# EasyEDA Pro project ax08_doc.eprj, board io
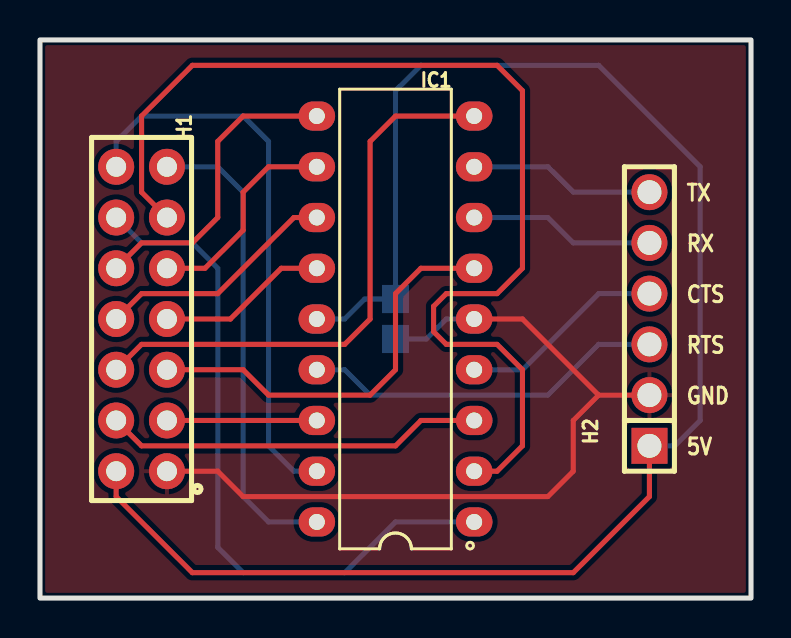
[diagram p28: board, top side]
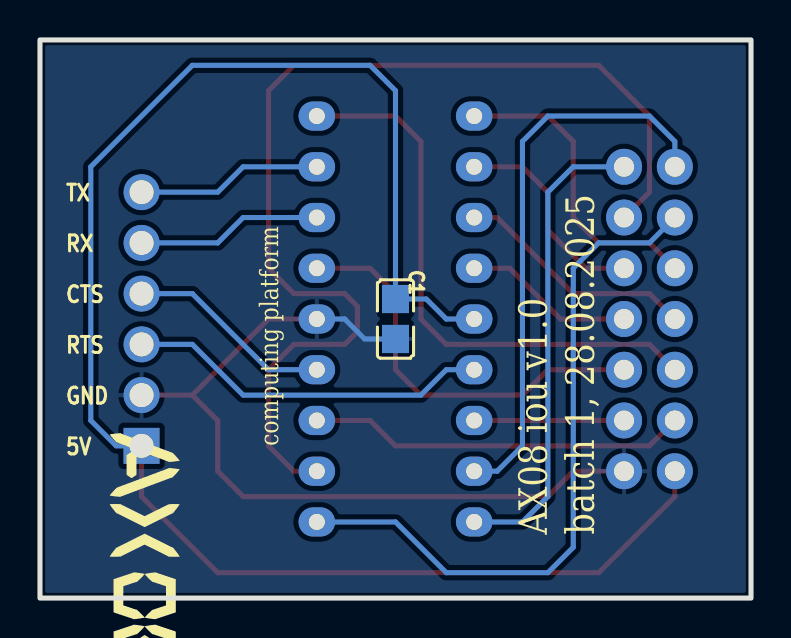
[diagram p29: board, bottom side, seen from below]

Outline 35.56 x 27.94 mm; copper layers: Top Layer, Bottom Layer. Coordinates in mm from the lower left corner of the outline.
Outline path: rectangle 0,27.94 35.56,0
Stack: Top Layer 0.035mm / Dielectric1 1.51mm FR4 er 4.5 / Bottom Layer 0.035mm

## Design rules (mm)
template: JLCPCB Capability(Two Layers Board)
spacing copperThickness1oz (default): track to track 0.102, other pairs 0.152 to 0.3
spacing copperThickness2oz: track to track 0.203, other pairs 0.152 to 0.3
track width copperThickness1oz (default): min 0.127, default 0.254, max 2.54
track width copperThickness2oz: min 0.203, default 0.254, max 2.54
differential pair differentialPair (default): width min 0.127, default 0.254, max 2.54; gap min 0.152, default 0.152
via viaSize (default): diameter min 0.5, default 0.61, max 10; hole min 0.3, default 0.305, max 6.3

## Placement (name value [footprint] x y rotation side)
C1  100nF  [C0805]  17.78 13.97 90 bottom
H1  PM254-2-07-Z-8.5  [HDR-TH_14P-P2.54-V-F-R2-C7-S2.54]  5.08 13.97 90 top
H2  2.54-1x6P直针  [HDR-TH_6P-P2.54-V-M-1]  30.48 13.97 90 top
IC1  PIC16F1847-I/P  [PDIP-18_L22.9-W6.4-P2.54-LS7.9-BL]  17.78 13.97 90 top

## Footprints (pads in the part's own frame, mm; a bottom-side part is the same pattern mirrored in y, then rotated)
C0805
  rect 1.41x1.35 smd: 1(-1,0) 2(1,0)
HDR-TH_6P-P2.54-V-M-1
  rect 1.8x1.8 hole 1.2: 1(-6.35,0)
  round 1.8 hole 1.2: 2(-3.81,0) 3(-1.27,0) 4(1.27,0) 5(3.81,0) 6(6.35,0)
HDR-TH_14P-P2.54-V-F-R2-C7-S2.54
  round 1.8 hole 1: 1(-7.62,-1.27) 2(-7.62,1.27) 3(-5.08,-1.27) 4(-5.08,1.27) 5(-2.54,-1.27) 6(-2.54,1.27) 7(0,-1.27) 8(0,1.27) 9(2.54,-1.27) 10(2.54,1.27) 11(5.08,-1.27) 12(5.08,1.27) 13(7.62,-1.27) 14(7.62,1.27)
PDIP-18_L22.9-W6.4-P2.54-LS7.9-BL
  oval 1.462x1.827 hole 0.8: 1(-10.16,-3.935) 2(-7.62,-3.935) 3(-5.08,-3.935) 4(-2.54,-3.935) 5(0,-3.935) 6(2.54,-3.935) 7(5.08,-3.935) 8(7.62,-3.935) 9(10.16,-3.935) 10(10.16,3.935) 11(7.62,3.935) 12(5.08,3.935) 13(2.54,3.935) 14(0,3.935) 15(-2.54,3.935) 16(-5.08,3.935) 17(-7.62,3.935) 18(-10.16,3.935)

## Nets
As in the schematic.

## Routing (per net, layer and track width the routed paths; a pad name or vN(x,y) marks a point on that pad's centre or on a via; arc(x,y) is an arc through that point)
+5V: length 82.1
  Top Layer w0.254: H1.2 3.81,5.08 7.62,1.27 26.67,1.27 30.48,5.08 H2.1
  Bottom Layer w0.254: H2.1 31.75,7.62 33.02,8.89 33.02,21.59 27.94,26.67 19.05,26.67 17.78,25.4 C1.2 16.24,14.97 15.24,13.97 IC1.14
GND: length 40.4
  Top Layer w0.254: H1.1 8.89,6.35 10.16,5.08 25.4,5.08 26.67,6.35 26.67,8.89 27.94,10.16 ; 27.94,10.16 24.13,13.97 IC1.5 ; 27.94,10.16 H2.2
  Bottom Layer w0.254: C1.1 19.32,12.97 20.32,13.97 IC1.5
CTS: length 10.3
  Bottom Layer w0.254: H2.4 27.94,15.24 24.13,11.43 IC1.4
HOLD: length 19
  Top Layer w0.254: IC1.3 19.05,8.89 17.78,7.62 5.08,7.62 H1.4
IOX_B0: length 28.1
  Bottom Layer w0.254: IC1.17 12.7,6.35 11.43,7.62 11.43,22.86 10.16,24.13 5.08,24.13 3.81,22.86 H1.14
IOX_B1: length 23.8
  Bottom Layer w0.254: IC1.18 11.43,3.81 10.16,5.08 10.16,20.32 8.89,21.59 H1.13
IOX_B2: length 34.5
  Bottom Layer w0.254: H1.12 5.08,17.78 7.62,17.78 8.89,16.51 8.89,2.54 10.16,1.27 15.24,1.27 17.78,3.81 IC1.1
IOX_B3: length 53.6
  Top Layer w0.254: IC1.2 22.86,6.35 24.13,7.62 24.13,11.43 22.86,12.7 20.32,12.7 19.69,13.33 19.69,14.61 20.32,15.24 22.86,15.24 24.13,16.51 24.13,25.4 22.86,26.67 7.62,26.67 5.08,24.13 5.08,20.32 H1.11
IOX_B4: length 15.4
  Top Layer w0.254: IC1.10 10.16,24.13 8.89,22.86 8.89,19.05 7.62,17.78 5.08,17.78 H1.10
IOX_B5: length 10.7
  Top Layer w0.254: IC1.11 11.43,21.59 10.16,20.32 10.16,18.41 8.25,16.51 H1.9
IOX_B6: length 12.1
  Top Layer w0.254: IC1.12 12.7,19.05 8.89,15.24 5.08,15.24 H1.8
IOX_B7: length 8.5
  Top Layer w0.254: IC1.13 12.06,16.51 9.53,13.97 H1.7
NOT_OPCD_11X00: length 7.5
  Top Layer w0.254: IC1.16 H1.3
NOT_OPCD_11X01: length 20.8
  Top Layer w0.254: H1.5 10.16,11.43 11.43,10.16 16.51,10.16 17.78,11.43 17.78,15.24 19.05,16.51 IC1.6
NOT_OPCD_11X10: length 28.4
  Top Layer w0.254: IC1.9 17.78,24.13 16.51,22.86 16.51,13.97 15.24,12.7 5.08,12.7 H1.6
RTS: length 18.2
  Bottom Layer w0.254: IC1.15 15.24,11.43 16.51,10.16 25.4,10.16 27.94,12.7 H2.3
RX: length 9.3
  Bottom Layer w0.254: IC1.7 25.4,19.05 26.67,17.78 H2.5
TX: length 9.3
  Bottom Layer w0.254: IC1.8 25.4,21.59 26.67,20.32 H2.6

## Copper pours and planes (outline as drawn; the poured copper is in the pictures)
GND on Top Layer: 0,27.94 35.56,27.94 35.56,0 0,0
GND on Bottom Layer: 0,27.94 35.56,27.94 35.56,0 0,0

## Text on the board
Bottom Silkscreen Layer: TX | RX | CTS | RTS | GND | 5V | computing platform | AX08 iou v1.0 / batch 1, 28.08.2025
Top Silkscreen Layer: TX | RX | CTS | RTS | GND | 5V
